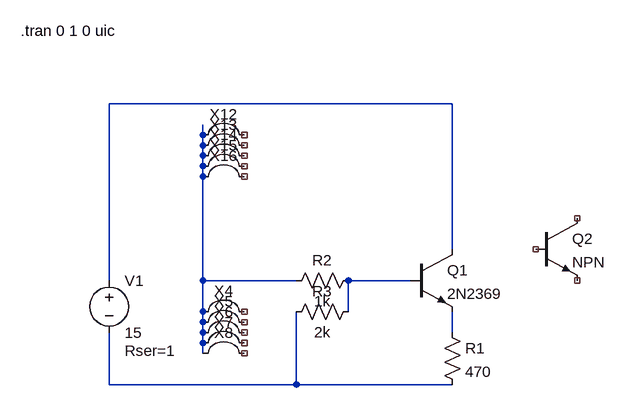
[diagram p0: schematic address decoder.asc]
address decoder.asc, the LTspice schematic file:
Version 4
SHEET 1 880 680
WIRE 416 64 -112 64
WIRE 32 112 32 96
WIRE 32 128 32 112
WIRE 32 144 32 128
WIRE 32 160 32 144
WIRE 32 176 32 160
WIRE 416 288 416 64
WIRE -112 336 -112 64
WIRE 32 336 32 176
WIRE 176 336 32 336
WIRE 352 336 256 336
WIRE 32 384 32 336
WIRE 256 384 256 336
WIRE 32 400 32 384
WIRE 32 416 32 400
WIRE 416 416 416 384
WIRE 32 432 32 416
WIRE 32 448 32 432
WIRE -112 496 -112 416
WIRE 176 496 176 384
WIRE 176 496 -112 496
WIRE 416 496 176 496
SYMBOL voltage -112 320 R0
WINDOW 123 0 0 Left 0
WINDOW 39 24 124 Left 2
SYMATTR SpiceLine Rser=1
SYMATTR InstName V1
SYMATTR Value 15
SYMBOL npn 352 288 R0
SYMATTR InstName Q1
SYMATTR Value 2N2369
SYMBOL Misc\\jumper 64 320 R0
SYMATTR InstName X4
SYMBOL Misc\\jumper 64 336 R0
SYMATTR InstName X5
SYMBOL Misc\\jumper 64 352 R0
SYMATTR InstName X6
SYMBOL Misc\\jumper 64 368 R0
SYMATTR InstName X7
SYMBOL Misc\\jumper 64 384 R0
SYMATTR InstName X8
SYMBOL Misc\\jumper 64 48 R0
SYMATTR InstName X12
SYMBOL Misc\\jumper 64 64 R0
SYMATTR InstName X13
SYMBOL Misc\\jumper 64 80 R0
SYMATTR InstName X14
SYMBOL Misc\\jumper 64 96 R0
SYMATTR InstName X15
SYMBOL Misc\\jumper 64 112 R0
SYMATTR InstName X16
SYMBOL res 400 400 R0
SYMATTR InstName R1
SYMATTR Value 470
SYMATTR SpiceLine tol=1 pwr=1
SYMBOL res 272 320 R90
WINDOW 0 0 56 VBottom 2
WINDOW 3 32 56 VTop 2
SYMATTR InstName R2
SYMATTR Value 1k
SYMATTR SpiceLine tol=1 pwr=5
SYMBOL res 272 368 R90
WINDOW 0 0 56 VBottom 2
WINDOW 3 32 56 VTop 2
SYMATTR InstName R3
SYMATTR Value 2k
SYMATTR SpiceLine tol=1 pwr=5
SYMBOL npn2 544 240 R0
SYMATTR InstName Q2
TEXT -248 -48 Left 2 !.tran 0 1 0 uic

The netlist it stands for:
* address decoder.asc
V1 N001 N005 15 Rser=1
Q1 N001 N003 N004 0 2N2369
R1 N004 N005 470 tol=1 pwr=1
R2 N003 N002 1k tol=1 pwr=5
R3 N003 N005 2k tol=1 pwr=5
Q2 NC_01 NC_02 NC_03 0 NPN
.model NPN NPN
.model PNP PNP
.lib standard.bjt
.tran 0 1 0 uic
.backanno
.end